# EAGLE design SQR_FG_Output (EAGLE 7.2.0)
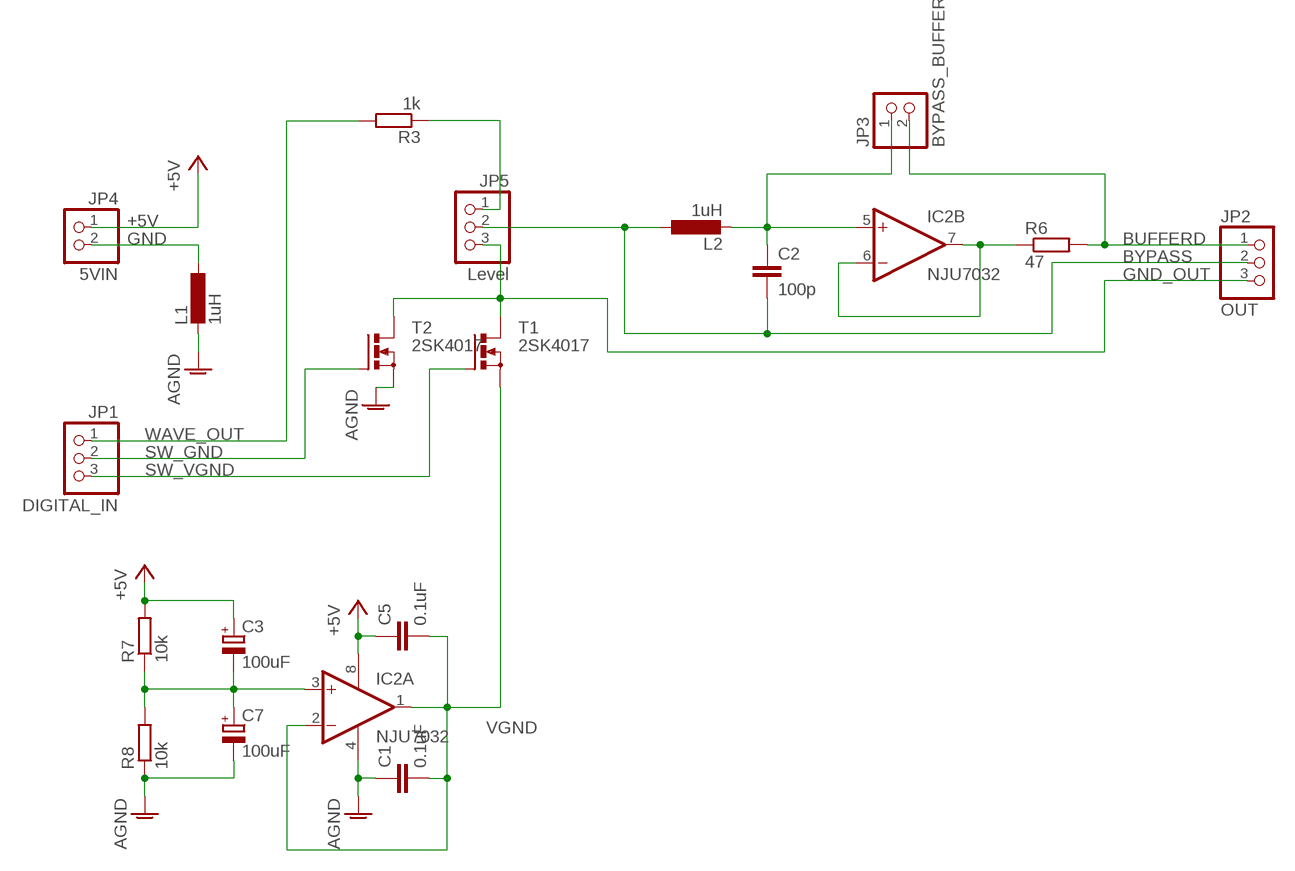
[diagram p0: schematic, sheet 1]

## Parts
C1  0.1uF  C-EU025-024X044  [C025-024X044]
C2  100p  C-EU075-032X103  [C075-032X103]
C3  100uF  CPOL-EUE2.5-5  [E2,5-5]
C5  0.1uF  C-EU025-024X044  [C025-024X044]
C7  100uF  CPOL-EUE2.5-5  [E2,5-5]
IC2  NJU7032  LM358N  [DIL08]
JP1  DIGITAL_IN  PINHD-1X3  [1X03]
JP2  OUT  PINHD-1X3  [1X03]
JP3  BYPASS_BUFFER  PINHD-1X2  [1X02]
JP4  5VIN  PINHD-1X2  [1X02]
JP5  Level  PINHD-1X3  [1X03]
L1  1uH  L-EU0204/7  [0204/7]
L2  1uH  L-EU0204/7  [0204/7]
R3  1k  R-EU_0207/7  [0207/7]
R6  47  R-EU_0207/7  [0207/7]
R7  10k  R-EU_0207/7  [0207/7]
R8  10k  R-EU_0207/7  [0207/7]
T1  2SK4017  BUZ11BV  [TO220BV]
T2  2SK4017  BUZ11BV  [TO220BV]

## Nets
+5V: C3.+ C5.1 IC2.8(P:V+) JP4.1 R7.2
AGND: C1.1 C7.- IC2.4(P:V-) L1.2 R8.1 T2.S
BUFFERD: JP2.1 JP3.2 R6.2
BYPASS: C2.2 JP2.2 JP5.2 L2.1
GND: JP4.2 L1.1
GND_OUT: JP2.3 JP5.3 T1.D T2.D
N$1: C2.1 IC2.5(B:+IN) JP3.1 L2.2
N$8: JP5.1 R3.1
N$16: IC2.6(B:-IN) IC2.7(B:OUT) R6.1
N$17: C3.- C7.+ IC2.3(A:+IN) R7.1 R8.2
SW_GND: JP1.2 T2.G
SW_VGND: JP1.3 T1.G
VGND: C1.2 C5.2 IC2.1(A:OUT) IC2.2(A:-IN) T1.S
WAVE_OUT: JP1.1 R3.2

## Library data of the parts
C1 C2 C5 = rcl:C-EU: CAPACITOR, European symbol
C3 C7 = rcl:CPOL-EU: POLARIZED CAPACITOR, European symbol
IC2 = linear:LM358: OP AMP also LM158; LM258; LM2904 Source: http://cache.national.com/ds/LM/LM158.pdf
JP1 JP2 JP5 = pinhead:PINHD-1X3: PIN HEADER
JP3 JP4 = pinhead:PINHD-1X2: PIN HEADER
L1 L2 = rcl:L-EU: INDUCTOR, European symbol
R3 R6-R8 = rcl:R-EU_: RESISTOR, European symbol
T1 T2 = transistor-power:BUZ11: N-CHANNEL MOS FET

## Board
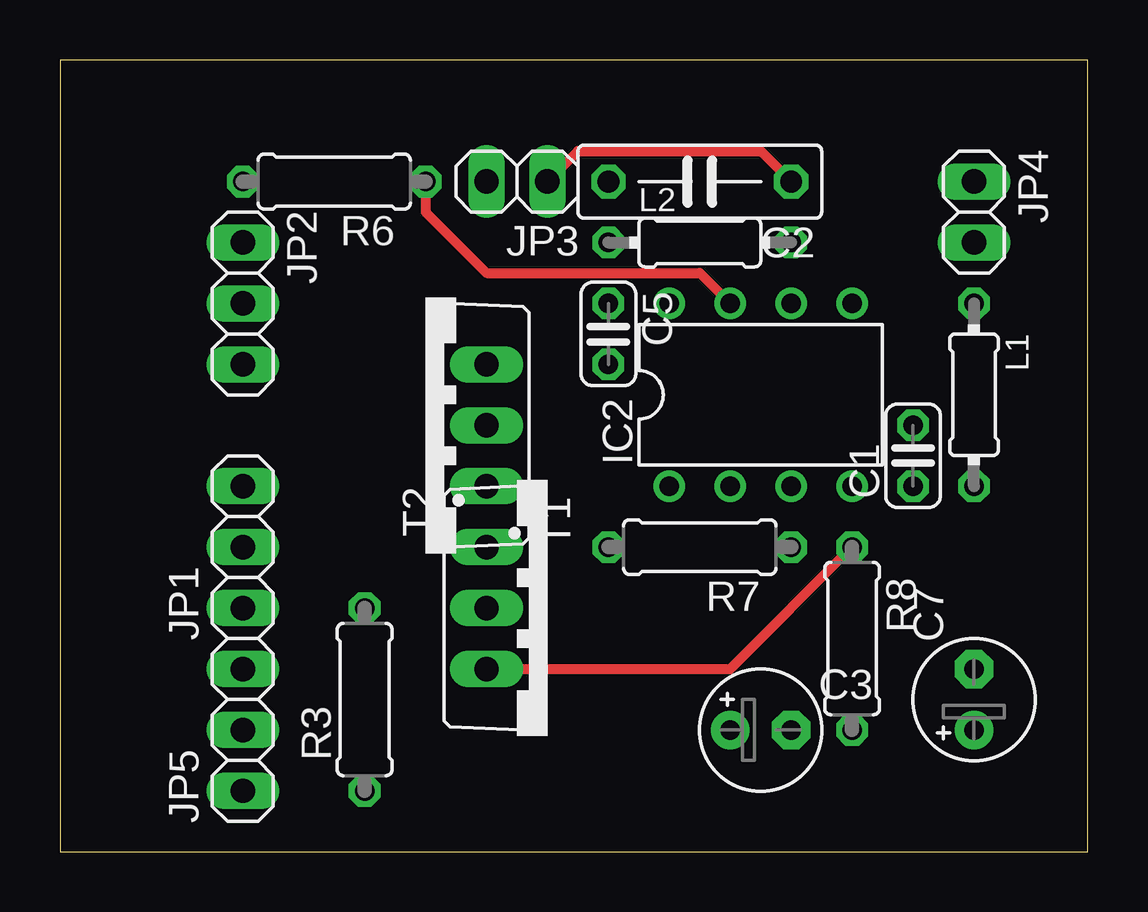
[diagram p1: board, top side]
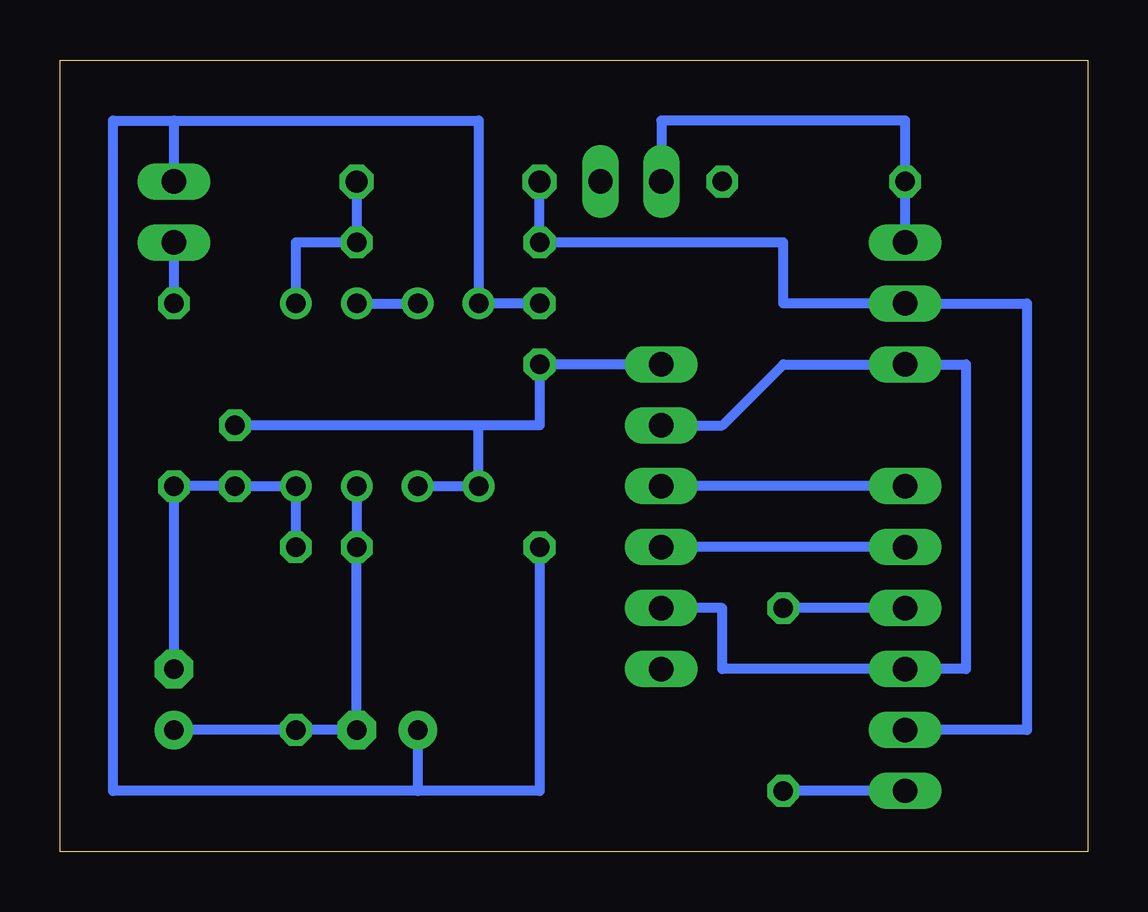
[diagram p2: board, bottom side, seen from below]

Size 42.85 x 33.01 mm. Coordinates in mm from the lower left corner, seen from the top.
Outline: 0,0 42.85,0 42.85,33.01 0,33.01 0,0
Copper layers (1*16): Top 0.035mm / dielectric 1.5mm / Bottom 0.035mm
Design rules "default": minimum track width 10mil, minimum drill 24mil, track to track 8mil, track to pad 8mil, pad to pad 8mil, via to via 8mil, smd to smd 8mil, copper to edge 40mil, drill to drill 8mil, minimum pad ring 10mil, minimum via ring 8mil, stop-mask expansion 4mil, vias tented up to drill 0mil, thermal gap 10mil

### Footprints (pad centres in the part's own frame; a part is rotated, then mirrored left to right if it is on the bottom)
C025-024X044 = drill 0.813 octagon: 1 -1.27,0; 2 1.27,0
C075-032X103 = drill 0.914 octagon: 1 -3.81,0; 2 3.81,0
E2,5-5 = drill 0.813 pad 1.6: + -1.27,0 | drill 0.813 pad 1.6 octagon: - 1.27,0
DIL08 = drill 0.813 pad 1.27: 1 -3.81,-3.81; 2 -1.27,-3.81; 3 1.27,-3.81; 4 3.81,-3.81; 5 3.81,3.81; 6 1.27,3.81; 7 -1.27,3.81; 8 -3.81,3.81
1X03 = drill 1.016 long: 1 -2.54,0; 2 0,0; 3 2.54,0
1X02 = drill 1.016 long: 1 -1.27,0; 2 1.27,0
0204/7 = drill 0.813 octagon: 1 -3.81,0; 2 3.81,0
0207/7 = drill 0.813 octagon: 1 -3.81,0; 2 3.81,0
TO220BV = drill 1.016 long: D 0,-2.54; G -2.54,-2.54; S 2.54,-2.54

### Placement (x,y rotation side)
C1  35.56,16.51 90 top
C2  26.67,27.94 180 top
C3  29.21,5.08 0 top
C5  22.86,21.59 270 top
C7  38.1,6.35 90 top
IC2  29.21,19.05 0 top
JP1  7.62,12.7 90 top
JP2  7.62,22.86 270 top
JP3  19.05,27.94 180 top
JP4  38.1,26.67 270 top
JP5  7.62,5.08 90 top
L1  38.1,19.05 270 top
L2  26.67,25.4 0 top
R3  12.7,6.35 90 top
R6  11.43,27.94 180 top
R7  26.67,12.7 180 top
R8  33.02,8.89 270 top
T1  15.24,17.78 90 top
T2  20.32,10.16 270 top

### Tracks (layer width: path | path; a pad name or v marks a point on that pad's centre or on a via)
+5V
  Bottom 0.406: 38.1,30.48 40.64,30.48 40.64,2.54 27.94,2.54 | 38.1,30.48 25.4,30.48 IC2.8 C5.1 | R7.2 22.86,2.54 27.94,2.54 | C3.+ 27.94,2.54 | JP4.1 38.1,30.48
AGND
  Top 0.406: T2.S 27.94,7.62 R8.1
  Bottom 0.406: R8.1 IC2.4 C1.1 L1.2 C7.-
BUFFERD
  Bottom 0.406: JP2.1 R6.2 7.62,30.48 17.78,30.48 JP3.2
BYPASS
  Bottom 0.406: C2.2 L2.1 12.7,25.4 12.7,22.86 JP2.2 2.54,22.86 2.54,5.08 JP5.2
GND
  Bottom 0.406: L1.1 JP4.2
GND_OUT
  Bottom 0.406: T1.D 15.24,17.78 12.7,20.32 JP2.3 5.08,20.32 5.08,7.62 JP5.3 15.24,7.62 15.24,10.16 T2.D
N$1
  Top 0.406: JP3.1 21.59,29.21 29.21,29.21 C2.1
  Bottom 0.406: C2.1 L2.2 33.02,25.4 IC2.5
N$8
  Bottom 0.406: JP5.1 R3.1
N$16
  Top 0.406: R6.1 15.24,26.67 17.78,24.13 26.67,24.13 IC2.7
  Bottom 0.406: IC2.6 IC2.7
N$17
  Bottom 0.406: IC2.3 R7.1 C3.- R8.2 C7.+
SW_GND
  Bottom 0.406: JP1.2 T2.G
SW_VGND
  Bottom 0.406: JP1.3 T1.G
VGND
  Bottom 0.406: 25.4,17.78 22.86,17.78 C5.2 T1.S | 25.4,17.78 C1.2 | 25.4,17.78 IC2.1 IC2.2
WAVE_OUT
  Bottom 0.406: JP1.1 R3.2